# EasyEDA schematic ферма.json
TITLE: Sheet_1; REV: 1.0; Date: 2024-05-22; Sheet: 1/1; Company: Your Company
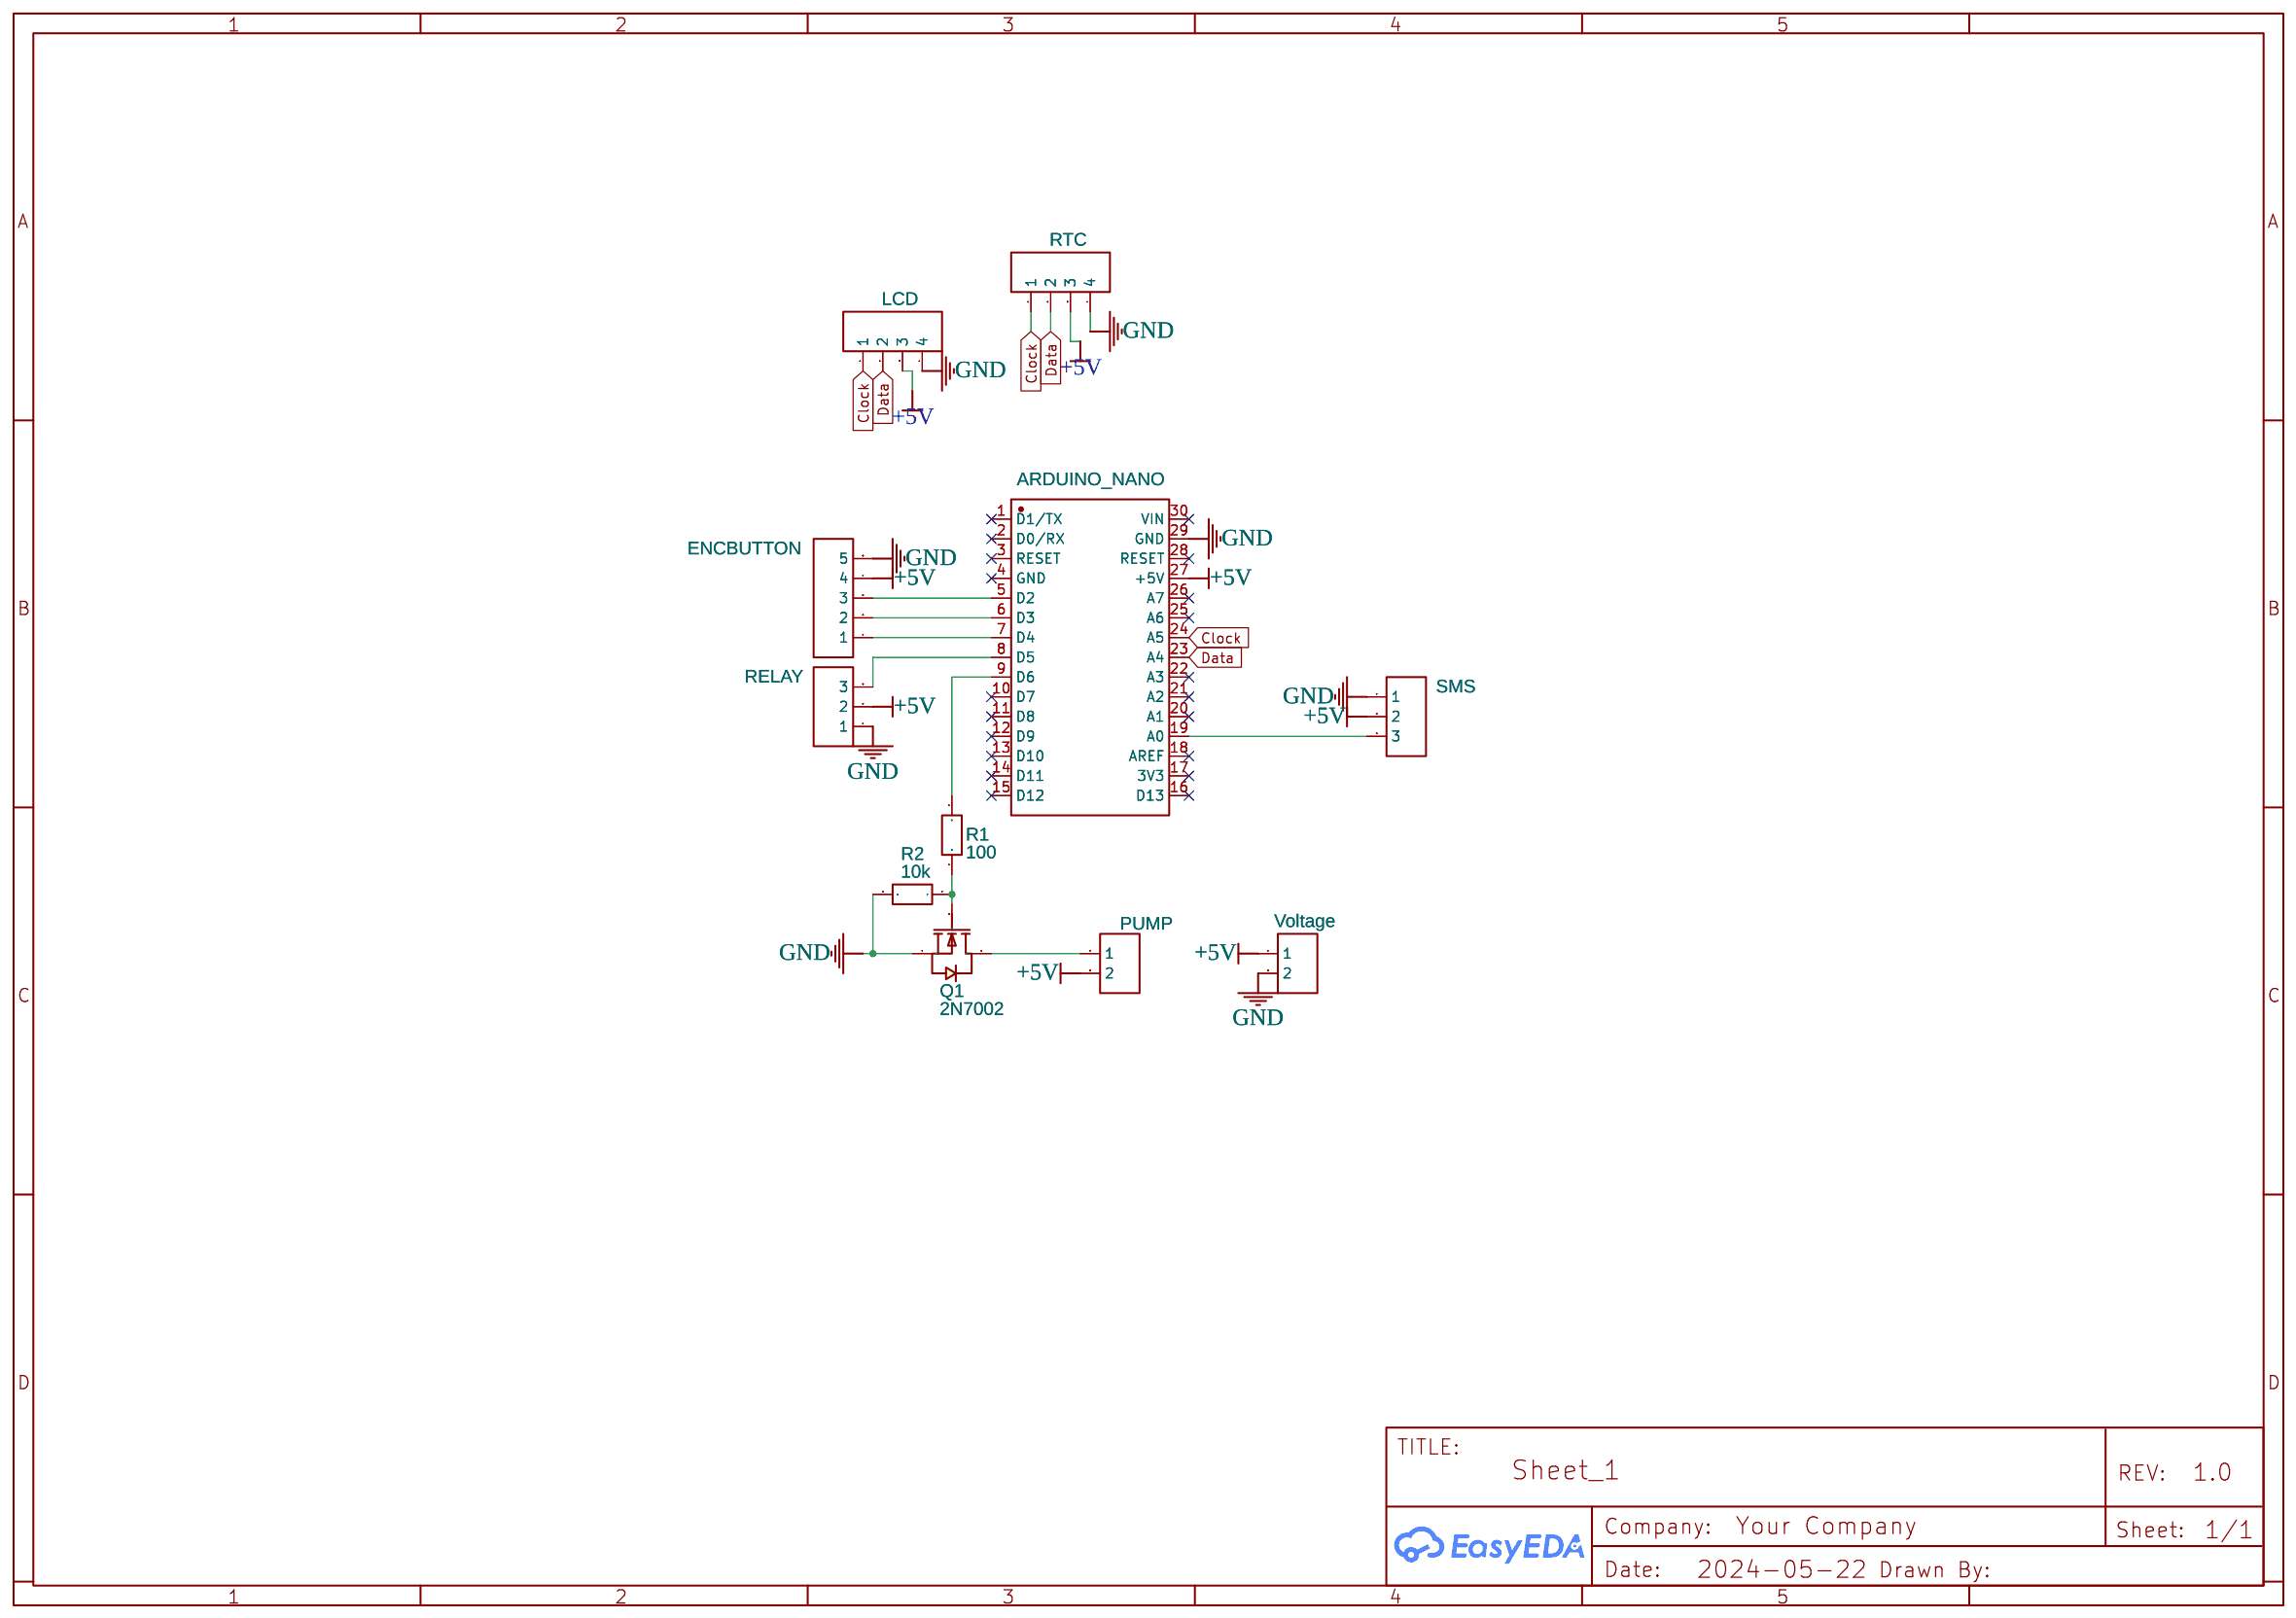
[diagram p0: schematic sheet]

## Parts
ENCBUTTON  HDR-M-2.54_1x5  [HDR-M-2.54_1X5]
H1  Voltage  [HDR-F-2.54_1X2]
J2  LCD  [HDR-M-2.54_1X4]
J3  RTC  [HDR-M-2.54_1X4]
PUMP  HDR-M-2.54_1x2  [HDR-M-2.54_1X2]
Q1  2N7002  [TO-92-3_L4.8-W3.7-P1.27-L]
R1  100  [R_AXIAL-0.3]
R2  10k  [R_AXIAL-0.3]
RELAY  HDR-M-2.54_1x3  [HDR-M-2.54_1X3]
SMS  HDR-M-2.54_1x3  [HDR-M-2.54_1X3]
U1  ARDUINO_NANO  [COMM-TH_ARDUINO_NANO]

## Library data of the parts
ENCBUTTON = HDR-M-2.54_1x5: Supplier Part: C358687; Supplier: LCSC; Contributor: LCEDA_Lib
H1 = HDR-F-2.54_1x2: Supplier Part: C49661; Supplier: LCSC; Contributor: LCEDA_Lib
J2 J3 = HDR-M-2.54_1x4: Supplier Part: C124378; Supplier: LCSC; Contributor: LCEDA_Lib
PUMP = HDR-M-2.54_1x2: Supplier Part: C124375; Supplier: LCSC; Contributor: LCEDA_Lib
Q1 = 2N7002: Supplier: LCSC; Manufacturer: Nexperia; Manufacturer Part: 2N7002,215; image: //image.lceda.cn/szlcsc/C65189.jpg; Supplier Part: C65189; Paste Type: expand; Contributor: LCEDA_Lib
R1 R2 = R_AXIAL-0.3_EU: Contributor: LCEDA_Lib
RELAY SMS = HDR-M-2.54_1x3: Supplier Part: C180248; Supplier: LCSC; Contributor: LCEDA_Lib
U1 = ARDUINO_NANO: Contributor: lcsc; Supplier: LCSC; Supplier Part: C9900017879; Manufacturer: null; JLCPCB Part Class: Extended Part

## Nets
+5V: ENCBUTTON.4 H1.1 J2.3 J3.3 PUMP.2 RELAY.2 SMS.2 U1.27(+5V)
GND: ENCBUTTON.5 H1.2 J2.4 J3.4 Q1.1(S) R2.2 RELAY.1 SMS.1 U1.29(GND)
Clock: J2.1 J3.1 U1.24(A5)
Data: J2.2 J3.2 U1.23(A4)
Net-(ENCBUTTON-1): ENCBUTTON.1 U1.7(D4)
Net-(ENCBUTTON-2): ENCBUTTON.2 U1.6(D3)
Net-(ENCBUTTON-3): ENCBUTTON.3 U1.5(D2)
Net-(PUMP-1): PUMP.1 Q1.3(D)
Net-(Q1-2): Q1.2(G) R1.1 R2.1
Net-(R1-2): R1.2 U1.9(D6)
Net-(RELAY-3): RELAY.3 U1.8(D5)
Net-(SMS-3): SMS.3 U1.19(A0)

Not connected (* = marked no-connect by the designer): U1 1(D1/TX)* 2(D0/RX)* 3(RESET)* 4(GND)* 10(D7)* 11(D8)* 12(D9)* 13(D10)* 14(D11)* 15(D12)* 16(D13)* 17(3V3)* 18(AREF)* 20(A1)* 21(A2)* 22(A3)* 25(A6)* 26(A7)* 28(RESET)* 30(VIN)*
